# EAGLE schematic robot_schematic (EAGLE 9.6.2)
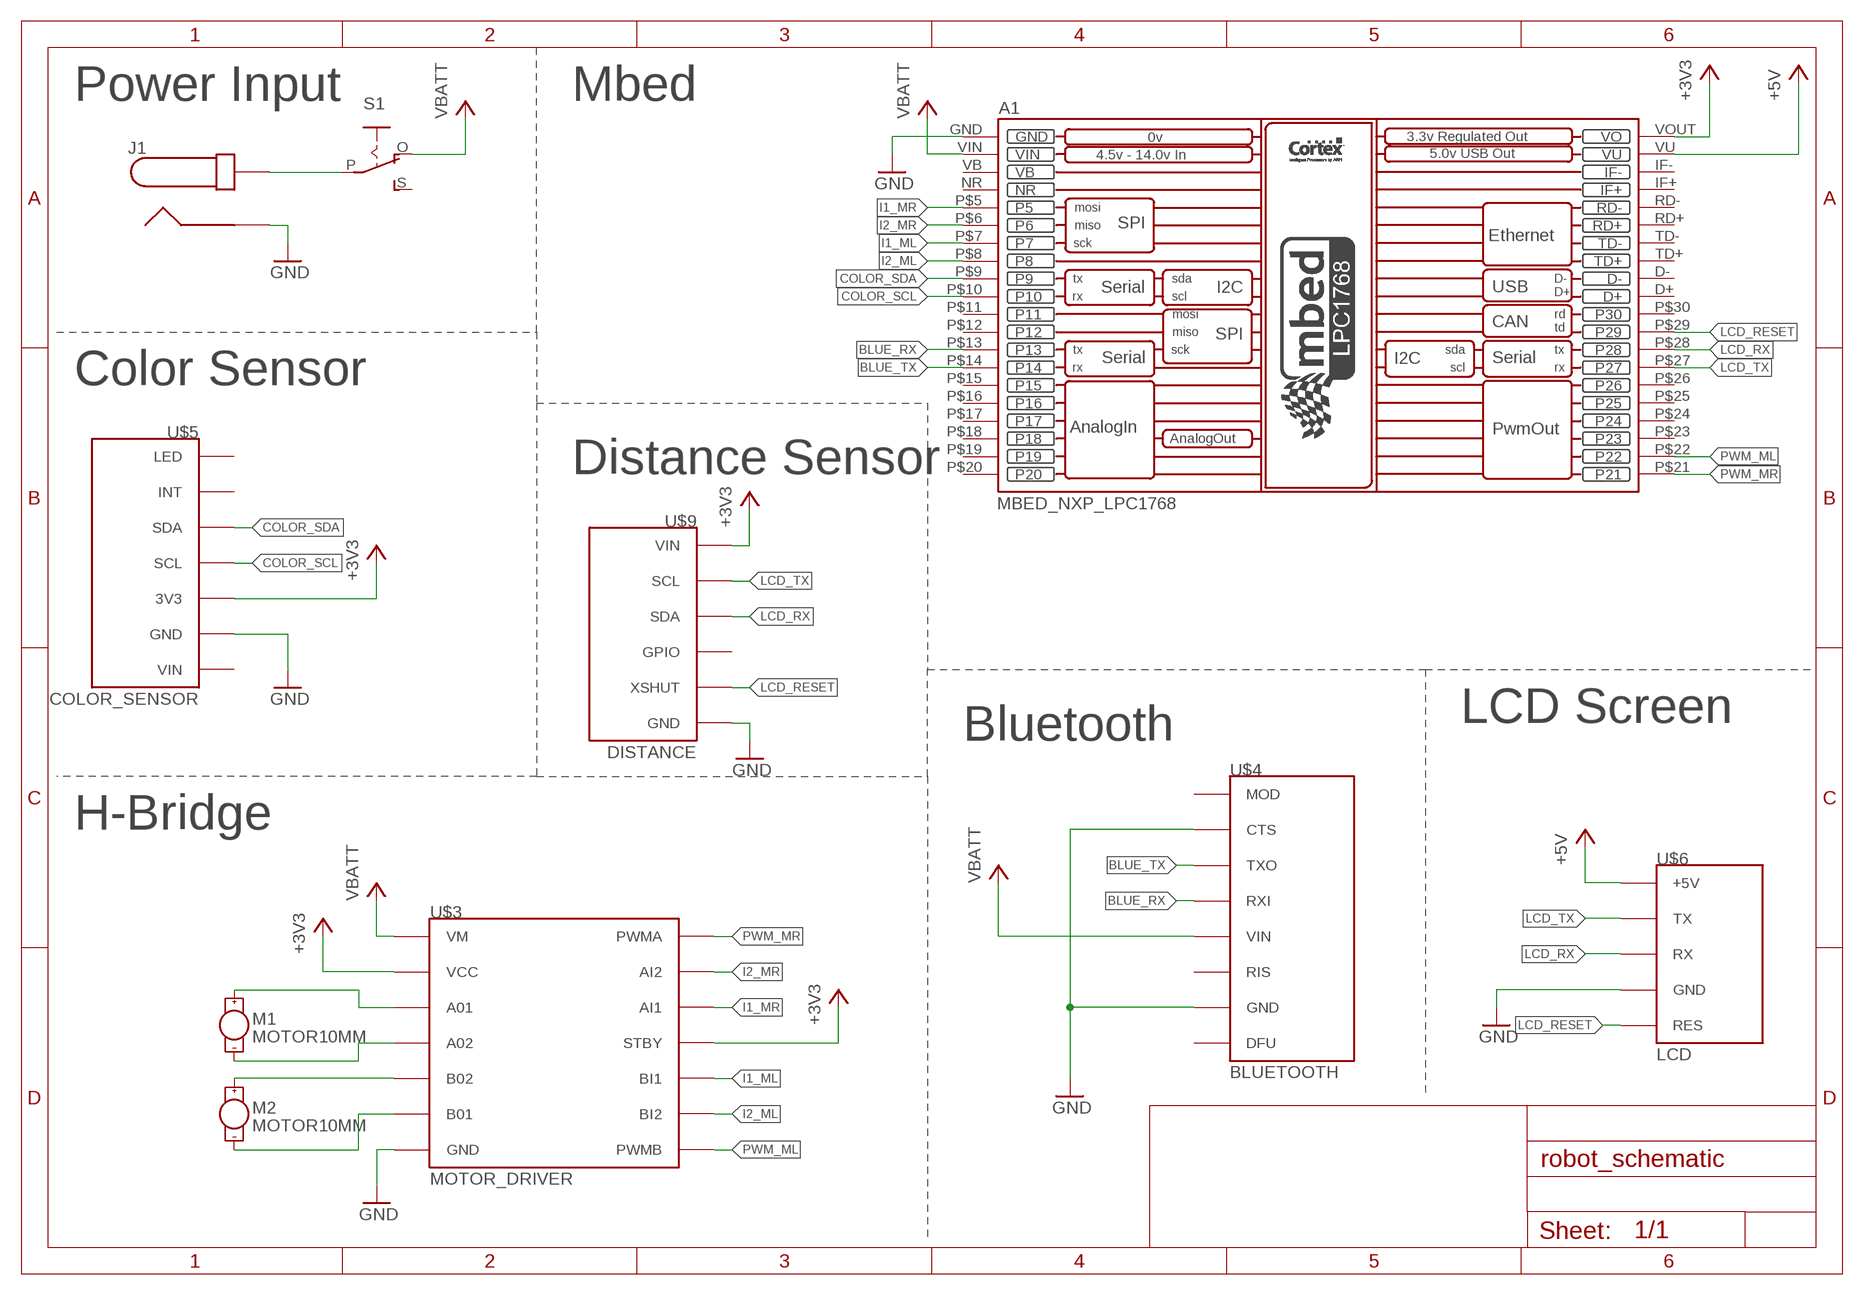
[diagram p0: schematic, sheet 1]

## Parts
A1  MBED_NXP_LPC1768  [MBED_LPC1768]
J1  PJ-037A  [PJ-037A]
M1  MOTOR10MM  [VIBE-MOTOR-10MM]
M2  MOTOR10MM  [VIBE-MOTOR-10MM]
S1  EG1218S  [EG1218]
U$3  MOTOR_DRIVER  (no package)
U$4  BLUETOOTH  (no package)
U$5  COLOR_SENSOR  (no package)
U$6  LCD  (no package)
U$9  DISTANCE  (no package)

## Nets
+3V3: A1.VOUT(VO) U$3.STBY U$3.VCC U$5.3V3 U$9.VIN
+5V: A1.VU U$6.+5V
BLUE_RX: A1.P$13(P13) U$4.RXI
BLUE_TX: A1.P$14(P14) U$4.TXO
COLOR_SCL: A1.P$10(P10) U$5.SCL
COLOR_SDA: A1.P$9(P9) U$5.SDA
GND: A1.GND J1.P$1 U$3.GND U$4.CTS U$4.GND U$5.GND U$6.GND U$9.GND
I1_ML: A1.P$7(P7) U$3.BI1
I1_MR: A1.P$5(P5) U$3.AI1
I2_ML: A1.P$8(P8) U$3.BI2
I2_MR: A1.P$6(P6) U$3.AI2
LCD_RESET: A1.P$29(P29) U$6.RES U$9.XSHUT
LCD_RX: A1.P$28(P28) U$6.RX U$9.SDA
LCD_TX: A1.P$27(P27) U$6.TX U$9.SCL
N$1: J1.P$2 S1.P
N$2: M1.+ U$3.A01
N$3: M1.- U$3.A02
N$4: M2.+ U$3.B02
N$5: M2.- U$3.B01
PWM_ML: A1.P$22(P22) U$3.PWMB
PWM_MR: A1.P$21(P21) U$3.PWMA
VBATT: A1.VIN S1.O U$3.VM U$4.VIN
Unconnected: A1.D+ A1.D- A1.IF+ A1.IF- A1.NR A1.P$11(P11) A1.P$12(P12) A1.P$15(P15) A1.P$16(P16) A1.P$17(P17) A1.P$18(P18) A1.P$19(P19) A1.P$20(P20) A1.P$23(P23) A1.P$24(P24) A1.P$25(P25) A1.P$26(P26) A1.P$30(P30) A1.RD+ A1.RD- A1.TD+ A1.TD- A1.VB S1.S U$4.DFU U$4.MOD U$4.RIS U$5.INT U$5.LED U$5.VIN U$9.GPIO

## Notes on the sheet
- Power Input | Mbed
- Color Sensor
- Distance Sensor
- LCD Screen
- Bluetooth
- H-Bridge

## Library data of the parts
A1 = RoboJackets-Boards:MBED_NXP_LPC1768: Mbed LPC1768 - ARM CORTEX v2.1 Website <https://os.mbed.com/platforms/mbed-LPC1768/>; DKPN: 568-4916-ND
J1 = RoboJackets-Connectors:PJ-037A*: Description: Power Barrel Connector Jack 2.10mm ID (0.083"), 5.50mm OD (0.217") Through Hole, Right Angle Link 2.5A: Digi-Key <https://www.digikey.com/products/en?keywords=CP-037A-ND> Link 5A: Digi-Key <https://www.digikey.com/product-detail/en/cui-devices/PJ-037AH/CP-037AH-ND/1644547>; DKPN: CP-037A-ND
M1 M2 = SparkFun-Electromechanical:MOTOR: Motor (Single-Phase) Two-terminal, single-phase motors. SparkFun Products Vibration Motor <https://www.sparkfun.com/products/8449> (ROB-08449) Physical dimension and wire connections for this powerful vibration motor. Motor has a self adhesive backing.; PROD_ID: COMP-08572; SF_SKU: ROB-08449
S1 = adafruit:EG1218: SLIDING SWITCH 0.1" spacing through hole, vertical SPDT slide switch http://www.ladyada.net/library/pcb/eaglelibrary.html
U$3 = schematic_sym:MOTOR_DRIVER
U$4 = schematic_sym:BLUETOOTH
U$5 = schematic_sym:COLOR_SENSOR
U$6 = schematic_sym:LCD
U$9 = schematic_sym:DISTANCE